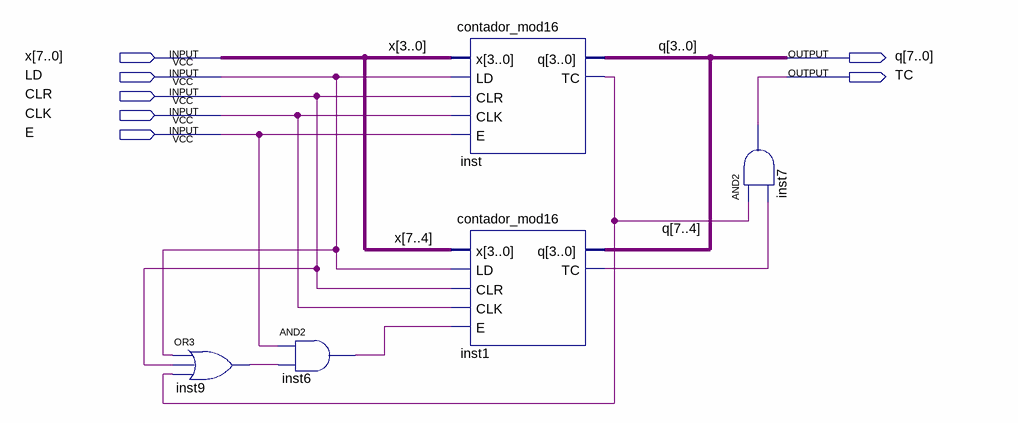
[diagram p0: schematic sheet]
// Quartus schematic contador_mod_256.bdf as structural Verilog: 5 symbols, 7 pins
module contador_mod_256 (
  input  [7:0] x,
  input  LD,
  input  CLR,
  input  CLK,
  input  E,
  output [7:0] q,
  output TC
);

  wire inst1_tc, inst6_out, inst9_out, inst_tc;

  or inst9 (inst9_out, LD, CLR, inst_tc);
  and inst6 (inst6_out, E, inst9_out);
  contador_mod16 inst (.x(x[3:0]), .LD(LD), .CLR(CLR), .CLK(CLK), .E(E), .q(q[3:0]), .TC(inst_tc));
  contador_mod16 inst1 (.x(x[7:4]), .LD(LD), .CLR(CLR), .CLK(CLK), .E(inst6_out), .q(q[7:4]), .TC(inst1_tc));
  and inst7 (TC, inst_tc, inst1_tc);
endmodule
